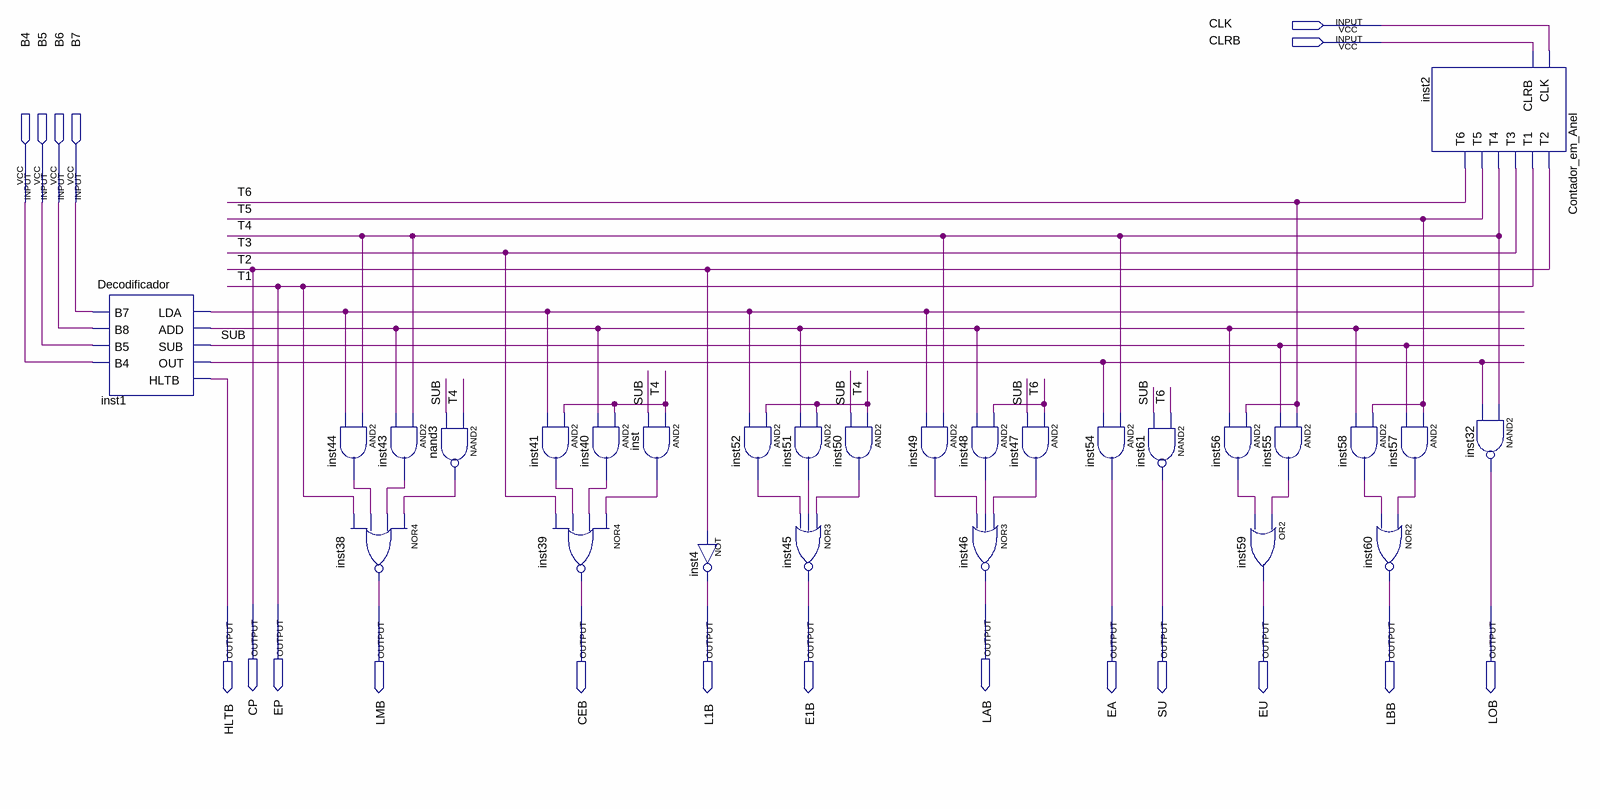
[diagram p0: schematic sheet]
// Quartus schematic Controlador_Sequencializador.bdf as structural Verilog: 28 symbols, 19 pins
module Controlador_Sequencializador (
  input  CLK,
  input  CLRB,
  input  B4,
  input  B5,
  input  B6,
  input  B7,
  output HLTB,
  output CP,
  output EP,
  output LMB,
  output CEB,
  output L1B,
  output E1B,
  output LAB,
  output EA,
  output SU,
  output EU,
  output LBB,
  output LOB
);

  wire inst1_add, inst1_lda, inst1_out, inst40_out, inst41_out, inst43_out, inst44_out, inst47_out,
       inst48_out, inst49_out, inst50_out, inst51_out, inst52_out, inst55_out, inst56_out, inst57_out,
       inst58_out, inst_out, nand3_out, SUB, T3, T4, T5, T6;

  Decodificador inst1 (
    .B7(B7), .B8(B6), .B5(B5), .B4(B4), .LDA(inst1_lda), .ADD(inst1_add), .SUB(SUB), .OUT(inst1_out),
    .HLTB(HLTB));
  and inst44 (inst44_out, T4, inst1_lda);
  nor inst38 (LMB, nand3_out, inst43_out, inst44_out, EP);
  and inst43 (inst43_out, T4, inst1_add);
  nand nand3 (nand3_out, T4, SUB);
  and inst41 (inst41_out, T4, inst1_lda);
  nor inst39 (CEB, inst_out, inst40_out, inst41_out, T3);
  and inst40 (inst40_out, T4, inst1_add);
  and inst (inst_out, T4, SUB);
  and inst52 (inst52_out, T4, inst1_lda);
  not inst4 (L1B, CP);
  and inst51 (inst51_out, T4, inst1_add);
  nor inst45 (E1B, inst50_out, inst51_out, inst52_out);
  and inst50 (inst50_out, T4, SUB);
  and inst49 (inst49_out, T4, inst1_lda);
  and inst47 (inst47_out, T6, SUB);
  and inst48 (inst48_out, T6, inst1_add);
  nor inst46 (LAB, inst47_out, inst48_out, inst49_out);
  and inst54 (EA, T4, inst1_out);
  nand inst61 (SU, T6, SUB);
  and inst56 (inst56_out, T6, inst1_add);
  and inst55 (inst55_out, T6, SUB);
  or inst59 (EU, inst55_out, inst56_out);
  and inst58 (inst58_out, T5, inst1_add);
  Contador_em_Anel inst2 (.CLK(CLK), .CLRB(CLRB), .T2(CP), .T1(EP), .T3(T3), .T4(T4), .T5(T5), .T6(T6));
  and inst57 (inst57_out, T5, SUB);
  nor inst60 (LBB, inst57_out, inst58_out);
  nand inst32 (LOB, T4, inst1_out);

  // Other names for the same wires on the sheet: T1 = EP; T2 = CP
endmodule
